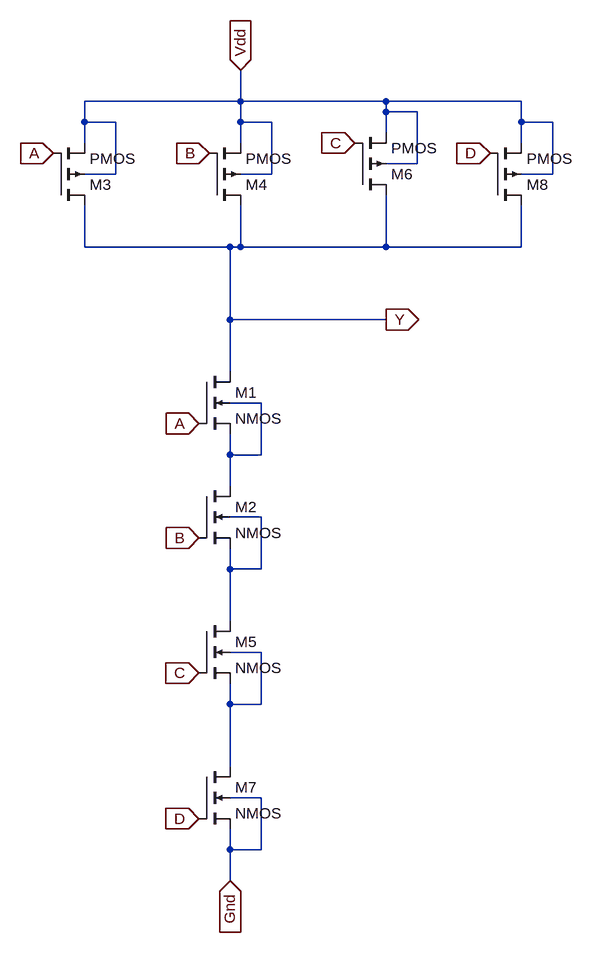
[diagram p0: schematic 4inand.asc]
4inand.asc, the LTspice schematic file:
Version 4
SHEET 1 880 776
WIRE 112 -528 112 -576
WIRE 112 -528 -128 -528
WIRE 336 -528 112 -528
WIRE 544 -528 336 -528
WIRE 336 -512 336 -528
WIRE 384 -512 336 -512
WIRE -128 -496 -128 -528
WIRE -80 -496 -128 -496
WIRE 112 -496 112 -528
WIRE 160 -496 112 -496
WIRE 544 -496 544 -528
WIRE 592 -496 544 -496
WIRE 336 -480 336 -512
WIRE -128 -464 -128 -496
WIRE 112 -464 112 -496
WIRE 544 -464 544 -496
WIRE 384 -432 384 -512
WIRE 384 -432 336 -432
WIRE -80 -416 -80 -496
WIRE -80 -416 -128 -416
WIRE 160 -416 160 -496
WIRE 160 -416 112 -416
WIRE 592 -416 592 -496
WIRE 592 -416 544 -416
WIRE -128 -304 -128 -368
WIRE 96 -304 -128 -304
WIRE 112 -304 112 -368
WIRE 112 -304 96 -304
WIRE 336 -304 336 -384
WIRE 336 -304 112 -304
WIRE 544 -304 544 -368
WIRE 544 -304 336 -304
WIRE 96 -192 96 -304
WIRE 336 -192 96 -192
WIRE 96 -112 96 -192
WIRE 144 -64 96 -64
WIRE 96 16 96 -16
WIRE 144 16 144 -64
WIRE 144 16 96 16
WIRE 96 64 96 16
WIRE 144 112 96 112
WIRE 96 192 96 160
WIRE 144 192 144 112
WIRE 144 192 96 192
WIRE 96 272 96 192
WIRE 144 320 96 320
WIRE 96 400 96 368
WIRE 144 400 144 320
WIRE 144 400 96 400
WIRE 96 496 96 400
WIRE 144 544 96 544
WIRE 96 624 96 592
WIRE 144 624 144 544
WIRE 144 624 96 624
WIRE 96 672 96 624
FLAG 48 144 B
IOPIN 48 144 In
FLAG 48 -32 A
IOPIN 48 -32 In
FLAG -176 -448 A
IOPIN -176 -448 In
FLAG 64 -448 B
IOPIN 64 -448 In
FLAG 336 -192 Y
IOPIN 336 -192 Out
FLAG 112 -576 Vdd
IOPIN 112 -576 In
FLAG 48 352 C
IOPIN 48 352 In
FLAG 288 -464 C
IOPIN 288 -464 In
FLAG 96 672 Gnd
IOPIN 96 672 In
FLAG 48 576 D
IOPIN 48 576 In
FLAG 496 -448 D
IOPIN 496 -448 In
SYMBOL nmos4 48 -112 R0
SYMATTR InstName M1
SYMBOL nmos4 48 64 R0
SYMATTR InstName M2
SYMBOL pmos4 -176 -368 M180
SYMATTR InstName M3
SYMBOL pmos4 64 -368 M180
SYMATTR InstName M4
SYMBOL nmos4 48 272 R0
SYMATTR InstName M5
SYMBOL pmos4 288 -384 M180
SYMATTR InstName M6
SYMBOL nmos4 48 496 R0
SYMATTR InstName M7
SYMBOL pmos4 496 -368 M180
SYMATTR InstName M8

The netlist it stands for:
* 4inand.asc
M1 Y A N001 N001 NMOS
M2 N001 B N002 N002 NMOS
M3 Y A Vdd Vdd PMOS
M4 Y B Vdd Vdd PMOS
M5 N002 C N003 N003 NMOS
M6 Y C Vdd Vdd PMOS
M7 N003 D Gnd Gnd NMOS
M8 Y D Vdd Vdd PMOS
.model NMOS NMOS
.model PMOS PMOS
.lib standard.mos
.backanno
.end